# EAGLE design IO_board (EAGLE 7.1.0)
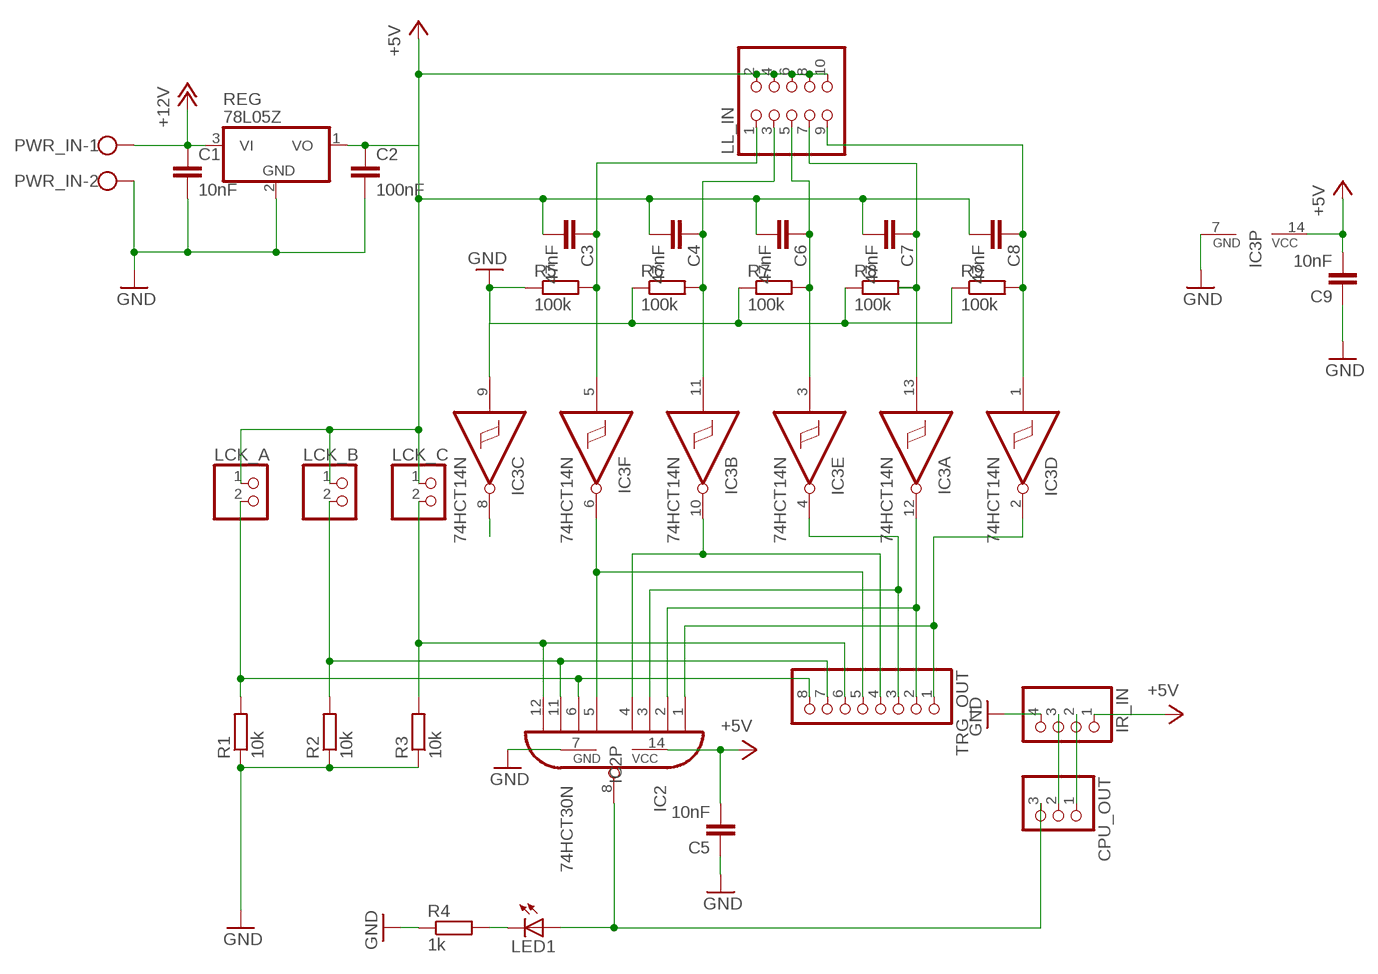
[diagram p0: schematic, sheet 1]

## Parts
C1  10nF  C-EU025-025X050  [C025-025X050]
C2  100nF  C-EU025-025X050  [C025-025X050]
C3  47nF  C-EU025-025X050  [C025-025X050]
C4  47nF  C-EU025-025X050  [C025-025X050]
C5  10nF  C-EU050-024X044  [C050-024X044]
C6  47nF  C-EU025-025X050  [C025-025X050]
C7  47nF  C-EU025-025X050  [C025-025X050]
C8  47nF  C-EU025-025X050  [C025-025X050]
C9  10nF  C-EU050-024X044  [C050-024X044]
CPU_OUT  PINHD-1X3  [1X03]
IC2  74HCT30N  [DIL14]
IC3  74HCT14N  [DIL14]
IR_IN  PINHD-1X4  [1X04]
LCK_A  PINHD-1X2  [1X02]
LCK_B  PINHD-1X2  [1X02]
LCK_C  PINHD-1X2  [1X02]
LED1  LED3MM  [LED3MM]
LL_IN  PINHD-2X5  [2X05]
PWR_IN  W237-102  [W237-102]
R1  10k  R-EU_0207/7  [0207/7]
R2  10k  R-EU_0207/7  [0207/7]
R3  10k  R-EU_0207/7  [0207/7]
R4  1k  R-EU_0207/7  [0207/7]
R5  100k  R-EU_0207/7  [0207/7]
R6  100k  R-EU_0207/7  [0207/7]
R7  100k  R-EU_0207/7  [0207/7]
R8  100k  R-EU_0207/7  [0207/7]
R9  100k  R-EU_0207/7  [0207/7]
REG  78L05Z  [TO92]
TRG_OUT  PINHD-1X8  [1X08]

## Nets
+5V [power]: C2.1 C3.2 C4.2 C5.2 C6.2 C7.2 C8.2 C9.2 IC2.14(VCC) IC3.14(P:VCC) IR_IN.1 LCK_A.1 LCK_B.1 LCK_C.1 LL_IN.2 LL_IN.4 LL_IN.6 LL_IN.8 LL_IN.10 REG.1(VO)
+12V: C1.1 PWR_IN.1 REG.3(VI)
GND: C1.2 C2.2 C5.1 C9.1 IC2.7(GND) IC3.7(P:GND) IR_IN.4 PWR_IN.2 R1.1 R2.1 R3.1 R4.1 R5.1 R6.1 R7.1 R8.1 R9.1 REG.2(GND)
N$1: IC2.2(I1) IC3.12(A:O) TRG_OUT.2
N$2: IC2.4(I3) IC3.10(B:O) TRG_OUT.4
N$3: IC3.8(C:O)
N$4: IC2.1(I0) IC3.2(D:O) TRG_OUT.1
N$6: CPU_OUT.3 IC2.8(O) LED1.A
N$8: C4.1 IC3.11(B:I) LL_IN.3 R6.2
N$9: CPU_OUT.2 IR_IN.3
N$10: C6.1 IC3.3(E:I) LL_IN.5 R7.2
N$11: C7.1 IC3.13(A:I) LL_IN.7 R8.2
N$12: C8.1 IC3.1(D:I) LL_IN.9 R9.2
N$13: CPU_OUT.1 IR_IN.2
N$14: IC2.5(I4) IC3.6(F:O) TRG_OUT.5
N$15: C3.1 IC3.5(F:I) LL_IN.1 R5.2
N$18: IC3.9(C:I)
N$20: IC2.3(I2) IC3.4(E:O) TRG_OUT.3
N$28: IC2.12(I7) LCK_C.2 R3.2 TRG_OUT.6
N$29: IC2.11(I6) LCK_B.2 R2.2 TRG_OUT.7
N$30: IC2.6(I5) LCK_A.2 R1.2 TRG_OUT.8
N$31: LED1.K(C) R4.2

## Library data of the parts
C1-C9 = rcl:C-EU: CAPACITOR, European symbol
CPU_OUT = pinhead:PINHD-1X3: PIN HEADER
IC2 = 74xx-eu:74*30: 8-input NAND gate
IC3 = 74xx-eu:74*14: Hex schmitt trigger INVERTER
IR_IN = pinhead:PINHD-1X4: PIN HEADER
LCK_A LCK_B LCK_C = pinhead:PINHD-1X2: PIN HEADER
LED1 = led:LED: LED OSRAM: - CHIPLED LG R971, LG N971, LY N971, LG Q971, LY Q971, LO R971, LY R971 LH N974, LH R974 LS Q976, LO Q976, LY Q976 LO Q996 - Hyper CHIPLED LW Q18S LB Q993, LB Q99A, LB R99A - SideLED LS A670, LO A670, LY A670, LG A670, LP A670 LB A673, LV A673, LT A673, LW A673 LH A674 LY A675 LS A676, LA A676, LO A676, LY A676, LW A676 LS A679, LY A679, LG A679 - Hyper Micro SIDELED® LS Y876, LA Y876, LO Y876, LY Y876 LT Y87S - SmartLED LW L88C, LW L88S LB L89C, LB L89S, LG L890 LS L89K, LO L89K, LY L89K LS L896, LA L896, LO L896, LY L896 - TOPLED LS T670, LO T670, LY T670, LG T670, LP T670 LSG T670, LSP T670, LSY T670, LOP T670, LYG T670 LG T671, LOG T671, LSG T671 LB T673, LV T673, LT T673, LW T673 LH T674 LS T676, LA T676, LO T676, LY T676, LB T676, LH T676, LSB T676, LW T676 LB T67C, LV T67C, LT T67C, LS T67K, LO T67K, LY T67K, LW E67C LS E67B, LA E67B, LO E67B, LY E67B, LB E67C, LV E67C, LT E67C LW T67C LS T679, LY T679, LG T679 LS T770, LO T770, LY T770, LG T770, LP T770 LB T773, LV T773, LT T773, LW T773 LH T774 LS E675, LA E675, LY E675, LS T675 LS T776, LA T776, LO T776, LY T776, LB T776 LHGB T686 LT T68C, LB T68C - Hyper Mini TOPLED® LB M676 - Mini TOPLED Santana® LG M470 LS M47K, LO M47K, LY M47K Source: http://www.osram.convergy.de LUXEON: - LUMILED® LXK2-PW12-R00, LXK2-PW12-S00, LXK2-PW14-U00, LXK2-PW14-V00 LXK2-PM12-R00, LXK2-PM12-S00, LXK2-PM14-U00 LXK2-PE12-Q00, LXK2-PE12-R00, LXK2-PE12-S00, LXK2-PE14-T00, LXK2-PE14-U00 LXK2-PB12-K00, LXK2-PB12-L00, LXK2-PB12-M00, LXK2-PB14-N00, LXK2-PB14-P00, LXK2-PB14-Q00 LXK2-PR12-L00, LXK2-PR12-M00, LXK2-PR14-Q00, LXK2-PR14-R00 LXK2-PD12-Q00, LXK2-PD12-R00, LXK2-PD12-S00 LXK2-PH12-R00, LXK2-PH12-S00 LXK2-PL12-P00, LXK2-PL12-Q00, LXK2-PL12-R00 Source: www.luxeon.com KINGBRIGHT: KA-3528ASYC Source: www.kingbright.com
LL_IN = pinhead:PINHD-2X5: PIN HEADER
PWR_IN = con-wago-500:W237-102: WAGO SCREW CLAMP; MPN: 237-102; OC_FARNELL: unknown; OC_NEWARK: 70K9898
R1-R9 = rcl:R-EU_: RESISTOR, European symbol
REG = linear:78*: Positive VOLTAGE REGULATOR Source: http://cache.national.com/ds/LM/LM78L05.pdf http://www.fairchildsemi.com/ds/LM/LM7805.pdf
TRG_OUT = pinhead:PINHD-1X8: PIN HEADER

## Net classes
1 power: width 0.4 mm

## Board
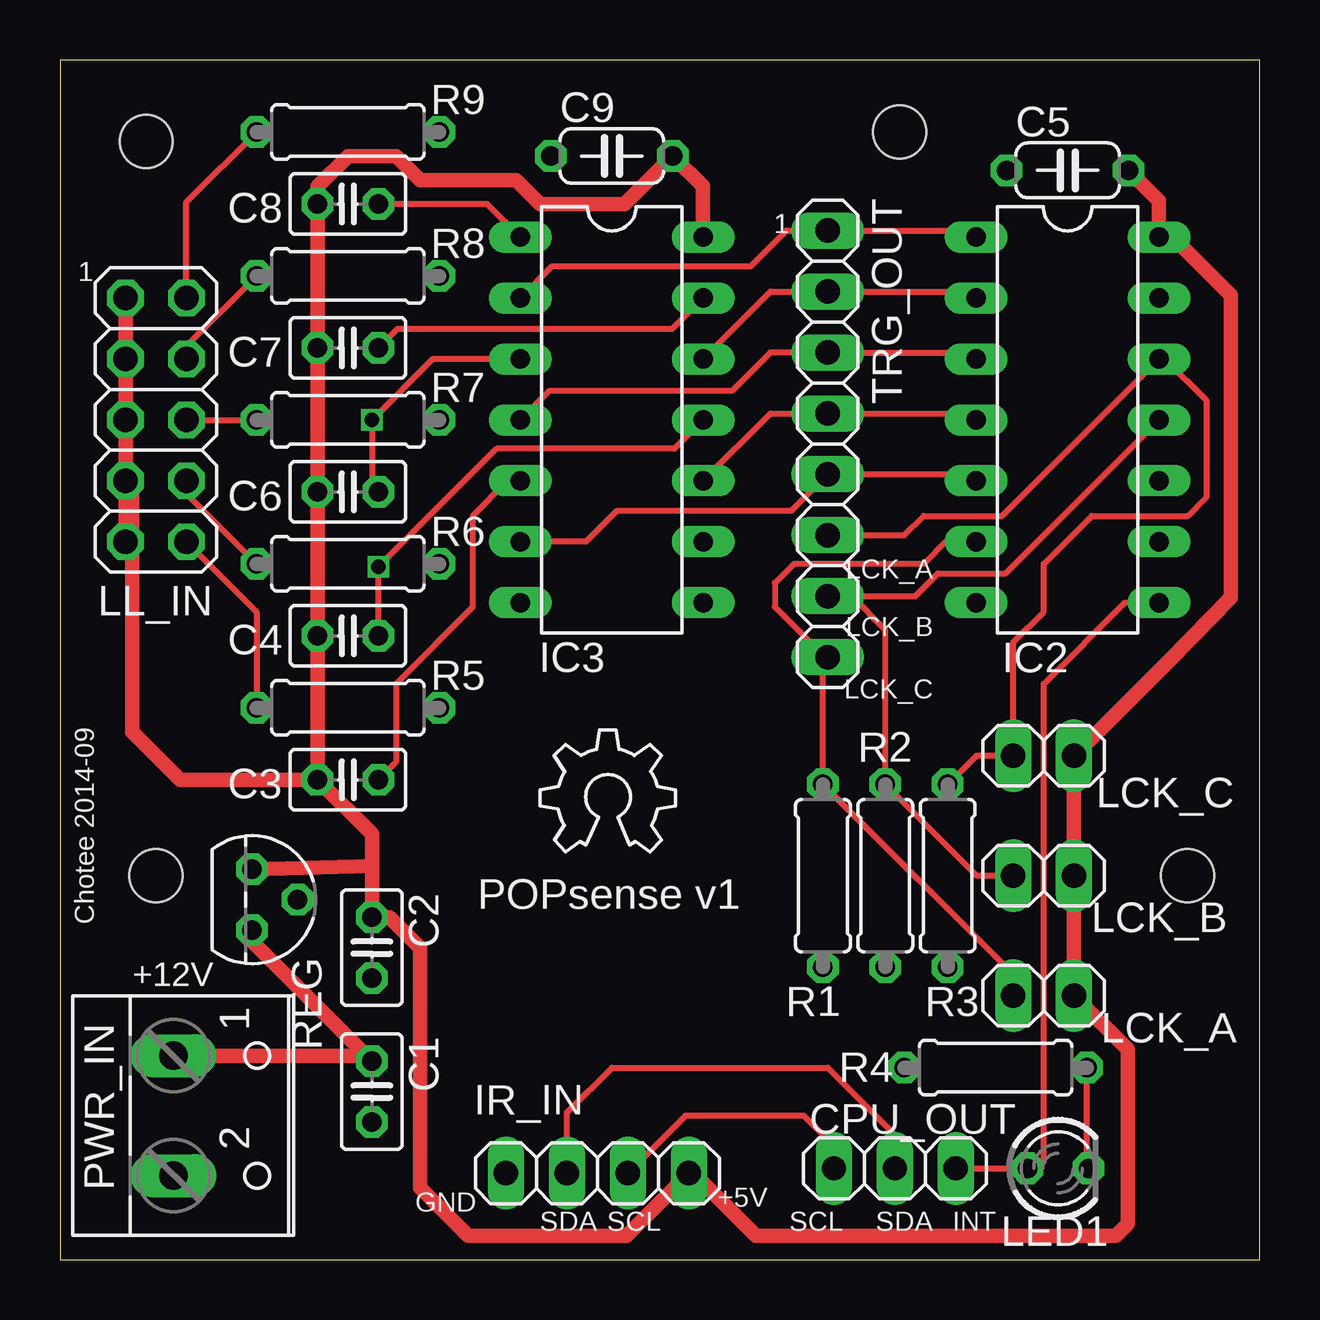
[diagram p1: board, top side]
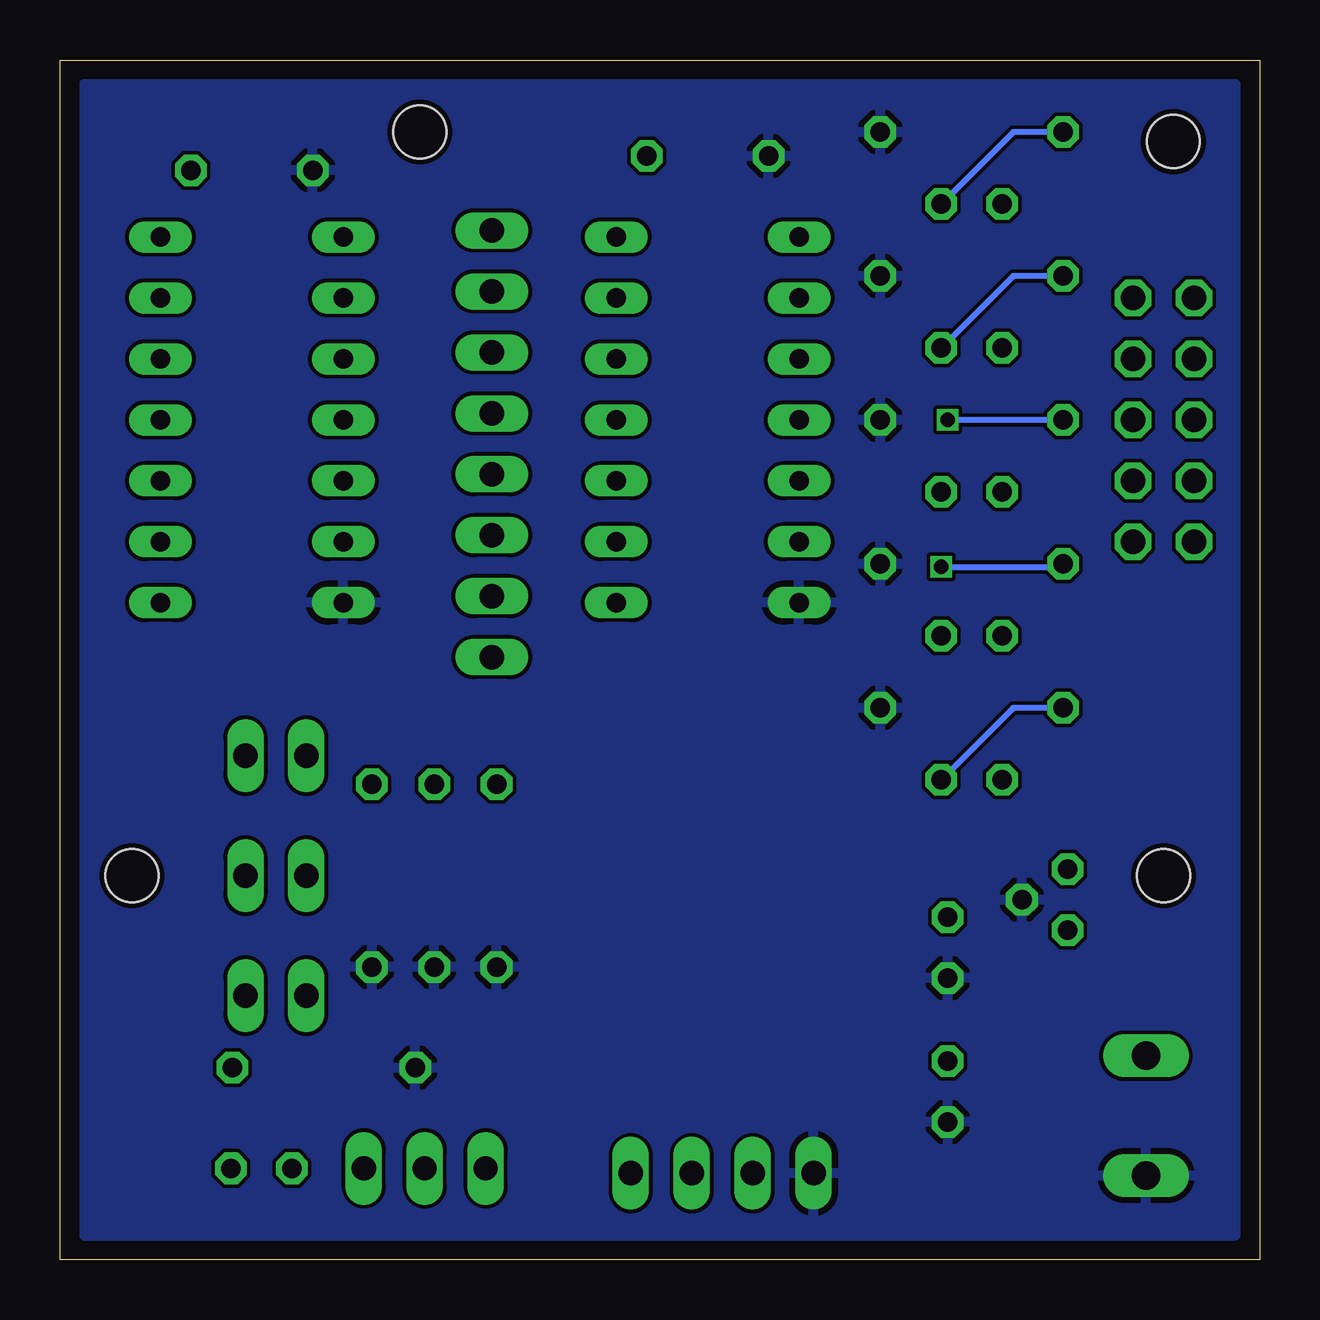
[diagram p2: board, bottom side, seen from below]

Size 50 x 50 mm. Coordinates in mm from the lower left corner, seen from the top.
Outline: 0,0 50,0 50,50 0,50 0,0
Copper layers (1*16): Top 0.035mm / dielectric 1.5mm / Bottom 0.035mm
Design rules "SeeedStudio_2layer_DRU_no_angle_20140221": minimum track width 6mil, minimum drill 12mil, track to track 6mil, track to pad 6mil, pad to pad 6mil, via to via 6mil, smd to smd 0mil, copper to edge 10mil, drill to drill 10mil, minimum pad ring 10mil, minimum via ring 6mil, stop-mask expansion 2mil, vias tented up to drill 100mil, thermal gap 10mil
Holes 2.2 mm at 4,16 35,47 3.6,46.6 47,16

### Footprints (pad centres in the part's own frame; a part is rotated, then mirrored left to right if it is on the bottom)
C025-025X050 = drill 0.813 octagon: 1 -1.27,0; 2 1.27,0
C050-024X044 = drill 0.813 octagon: 1 -2.54,0; 2 2.54,0
1X03 = drill 1.016 long: 1 -2.54,0; 2 0,0; 3 2.54,0
DIL14 = drill 0.813 long: 1 -7.62,-3.81; 2 -5.08,-3.81; 3 -2.54,-3.81; 4 0,-3.81; 5 2.54,-3.81; 6 5.08,-3.81; 7 7.62,-3.81; 8 7.62,3.81; 9 5.08,3.81; 10 2.54,3.81; 11 0,3.81; 12 -2.54,3.81; 13 -5.08,3.81; 14 -7.62,3.81
1X04 = drill 1.016 long: 1 -3.81,0; 2 -1.27,0; 3 1.27,0; 4 3.81,0
1X02 = drill 1.016 long: 1 -1.27,0; 2 1.27,0
LED3MM = drill 0.813 octagon: A -1.27,0; K 1.27,0
2X05 = drill 1.016 octagon: 1 -5.08,-1.27; 2 -5.08,1.27; 3 -2.54,-1.27; 4 -2.54,1.27; 5 0,-1.27; 6 0,1.27; 7 2.54,-1.27; 8 2.54,1.27; 9 5.08,-1.27; 10 5.08,1.27
W237-102 = drill 1.194 long: 1 -2.5,-1.27; 2 2.5,-1.27
0207/7 = drill 0.813 octagon: 1 -3.81,0; 2 3.81,0
TO92 = drill 0.813 octagon: 1 -1.27,0; 2 0,1.905; 3 1.27,0
1X08 = drill 1.016 long: 1 -8.89,0; 2 -6.35,0; 3 -3.81,0; 4 -1.27,0; 5 1.27,0; 6 3.81,0; 7 6.35,0; 8 8.89,0

### Placement (x,y rotation side)
C1  13,7 270 top
C2  13,13 270 top
C3  12,20 180 top
C4  12,26 180 top
C5  42,45.4 0 top
C6  12,32 180 top
C7  12,38 180 top
C8  12,44 180 top
C9  23,46 0 top
CPU_OUT  34.8,3.8 0 top
IC2  42,35 270 top
IC3  23,35 270 top
IR_IN  22.4,3.6 180 top
LCK_A  41,11 180 top
LCK_B  41,16 180 top
LCK_C  41,21 180 top
LED1  41.6,3.8 0 top
LL_IN  4,35 90 top
PWR_IN  6,6 270 top
R1  31.8,16 90 top
R2  34.4,16 90 top
R3  37,16 90 top
R4  39,8 0 top
R5  12,23 180 top
R6  12,29 180 top
R7  12,35 180 top
R8  12,41 180 top
R9  12,47 180 top
REG  8,15 270 top
TRG_OUT  32,34 270 top
U$1  [OSHW_6X200_NOTEXT]  20,17 0 top

### Tracks (layer width: path | path; a pad name or v marks a point on that pad's centre or on a via)
+5V
  Top 0.61: C3.2 C4.2 C6.2 C7.2 C8.2 10.73,44.73 12,46 14,46 15,45 19,45 20,44 23.54,44 C9.2 26.81,44.73 IC3.14 | LL_IN.10 LL_IN.8 LL_IN.6 LL_IN.4 | LL_IN.4 2.73,32.27 3,32 | 3,32 3,32.19 LL_IN.4 | LL_IN.4 LL_IN.2 | 3,32 3,22 5,20 C3.2 | REG.1 13,16.4 C2.1 | C2.1 13,17.73 C3.2 | C2.1 13.73,14.27 15,13 15,3 17,1 23.61,1 IR_IN.1 26.4,3.6 29,1 44,1 44.5,1.5 44.5,8.77 LCK_A.1 LCK_B.1 LCK_C.1 46.27,25 48.8,27.6 48.8,40.2 46.38,42.62 IC2.14 45.81,44.13 C5.2
+12V
  Top 0.61: PWR_IN.1 12.77,8.5 C1.1 8,13.27 REG.3
GND
  pour Bottom: 1,49 49,49 49,1 1,1
N$1
  Top 0.254: IC3.12 29.62,40.35 TRG_OUT.2 37.92,40.35 IC2.2
N$2
  Top 0.254: IC3.10 29.62,35.27 TRG_OUT.4 37.92,35.27 IC2.4
N$4
  Top 0.254: IC3.2 20.51,41.4 28.8,41.4 30.29,42.89 TRG_OUT.1 37.92,42.89 IC2.1
N$6
  Top 0.254: IC2.8 44.38,27.38 41,24 41,4.07 40.73,3.8 LED1.A CPU_OUT.3
N$8  (via drill 0.6)
  Top 0.254: LL_IN.3 5.27,31.92 R6.2 | IC3.11 25.61,33.8 18.2,33.8 v13.27,28.87 C4.1
  Bottom 0.254: v13.27,28.87 8.32,28.87 R6.2
N$9
  Top 0.254: IR_IN.3 21.13,6.13 23,8 32,8 35,5 35,4 CPU_OUT.2
N$10  (via drill 0.6)
  Top 0.254: LL_IN.5 R7.2 | IC3.3 15.54,37.54 v13,35 13,32.27 C6.1
  Bottom 0.254: R7.2 v13,35
N$11
  Top 0.254: LL_IN.7 5.27,38.08 R8.2 | C7.1 14.07,38.8 25.53,38.8 IC3.13
  Bottom 0.254: R8.2 10.27,41 C7.1
N$12
  Top 0.254: LL_IN.9 5.27,44.08 R9.2 | IC3.1 17.81,44 C8.1
  Bottom 0.254: R9.2 10.27,47 C8.1
N$13
  Top 0.254: CPU_OUT.1 32.26,4.74 31,6 26.07,6 IR_IN.2
N$14
  Top 0.254: IC3.6 21.92,29.92 23.2,31.2 30.47,31.2 TRG_OUT.5 37.92,32.73 IC2.5
N$15
  Top 0.254: LL_IN.1 8.19,27 R5.2 | IC3.5 18.66,32.46 17.2,31 17.2,27.2 14,24 14,20.73 C3.1
  Bottom 0.254: R5.2 10.27,23 C3.1
N$20
  Top 0.254: IC3.4 20.39,36.2 28,36.2 29.61,37.81 TRG_OUT.3 37.92,37.81 IC2.3
N$28
  Top 0.254: TRG_OUT.6 35.19,30.19 36,31 39.27,31 IC2.12 46.06,37.54 47.8,35.8 47.8,31.8 47,31 43,31 41,29 41,27 39.73,25.73 LCK_C.2 38.19,21 R3.2
N$29
  Top 0.254: TRG_OUT.7 33,27.65 | 33,27.65 35.65,27.65 36.6,28.6 39.41,28.6 IC2.11 | 33,27.65 34.4,26.25 R2.2 38.21,16 LCK_B.2
N$30
  Top 0.254: IC2.6 36.92,29.92 36,29 30.6,29 29.8,28.2 29.8,27.2 32,25 TRG_OUT.8 31.8,24.91 R1.2 39.73,11.88 LCK_A.2
N$31
  Top 0.254: LED1.K 42.81,3.86 R4.2

### Text on the board
tNames: 1 | 1 | 4 | 5 | 3 | 2 | 5 | LCK_A | 3 | 4 | 2 | LCK_B | LCK_C | Chotee 2014-09 | POPsense v1 | +12V | GND | +5V | SDA | SCL | SCL | SDA | INT